# EAGLE design Minimum LPC2148 (EAGLE 5.11)
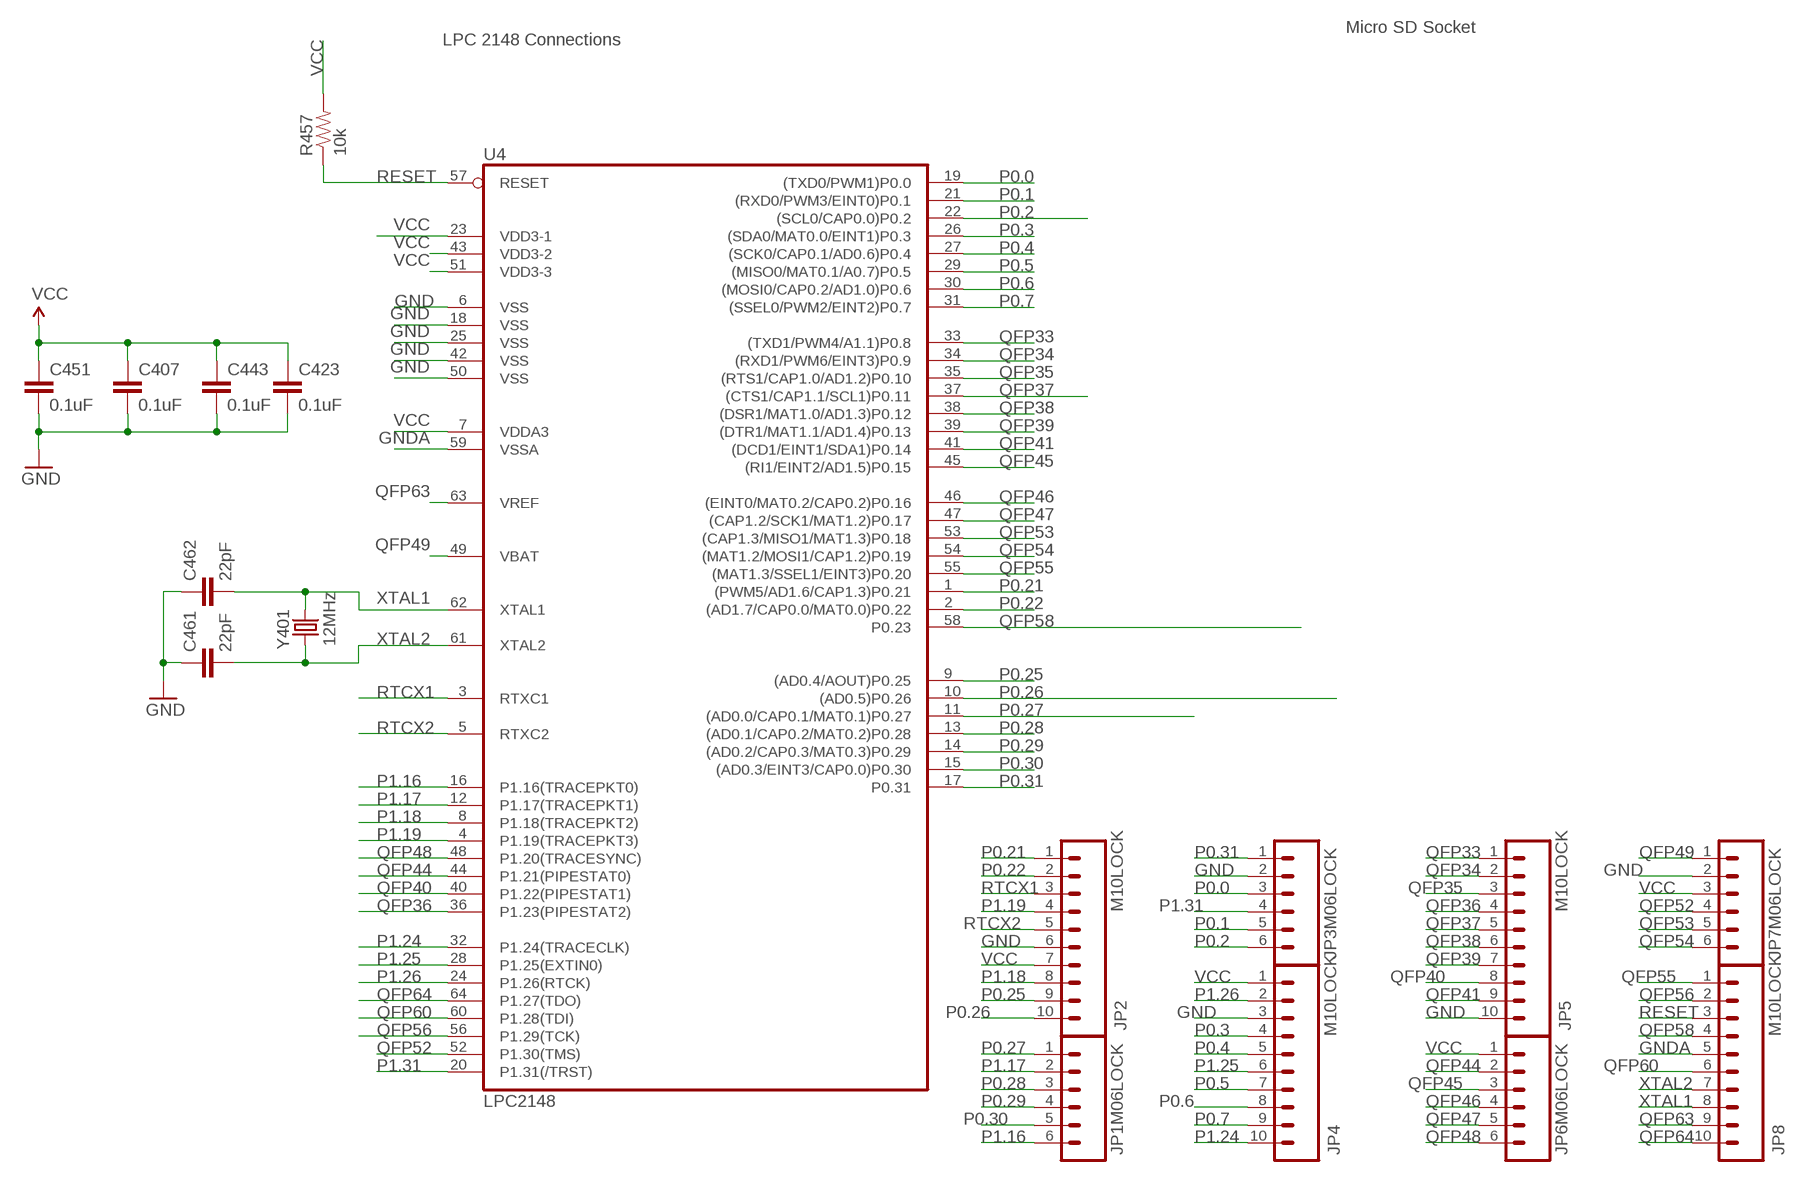
[diagram p0: schematic, sheet 1]

## Parts
C407  0.1uF  CAP0402-CAP  [0402-CAP]
C423  0.1uF  CAP0402-CAP  [0402-CAP]
C443  0.1uF  CAP0402-CAP  [0402-CAP]
C451  0.1uF  CAP0402-CAP  [0402-CAP]
C461  22pF  CAP0402-CAP  [0402-CAP]
C462  22pF  CAP0402-CAP  [0402-CAP]
JP1  M06LOCK  [1X06_LOCK]
JP2  M10LOCK  [1X10_LOCK]
JP3  M06LOCK  [1X06_LOCK]
JP4  M10LOCK  [1X10_LOCK]
JP5  M10LOCK  [1X10_LOCK]
JP6  M06LOCK  [1X06_LOCK]
JP7  M06LOCK  [1X06_LOCK]
JP8  M10LOCK  [1X10_LOCK]
R457  10k  RESISTOR0402-RES  [0402-RES]
U4  LPC2148  LPC213X  [SQFP-S-10X10-64]
Y401  12MHz  CRYSTAL5X3  [CRYSTAL-SMD-5X3]

## Nets
GND: C407.2 C423.2 C443.2 C451.2 C461.1 C462.1 JP2.6 JP3.2 JP4.3 JP5.10 JP7.2 U4.6(VSS) U4.18(VSS) U4.25(VSS) U4.42(VSS) U4.50(VSS)
GNDA: JP8.5 U4.59(VSSA)
P0.0: JP3.3 U4.19((TXD0/PWM1)P0.0)
P0.1: JP3.5 U4.21((RXD0/PWM3/EINT0)P0.1)
P0.2: JP3.6 U4.22((SCL0/CAP0.0)P0.2)
P0.3: JP4.4 U4.26((SDA0/MAT0.0/EINT1)P0.3)
P0.4: JP4.5 U4.27((SCK0/CAP0.1/AD0.6)P0.4)
P0.5: JP4.7 U4.29((MISO0/MAT0.1/A0.7)P0.5)
P0.6: JP4.8 U4.30((MOSI0/CAP0.2/AD1.0)P0.6)
P0.7: JP4.9 U4.31((SSEL0/PWM2/EINT2)P0.7)
P0.21: JP2.1 U4.1((PWM5/AD1.6/CAP1.3)P0.21)
P0.22: JP2.2 U4.2((AD1.7/CAP0.0/MAT0.0)P0.22)
P0.25: JP2.9 U4.9((AD0.4/AOUT)P0.25)
P0.26: JP2.10 U4.10((AD0.5)P0.26)
P0.27: JP1.1 U4.11((AD0.0/CAP0.1/MAT0.1)P0.27)
P0.28: JP1.3 U4.13((AD0.1/CAP0.2/MAT0.2)P0.28)
P0.29: JP1.4 U4.14((AD0.2/CAP0.3/MAT0.3)P0.29)
P0.30: JP1.5 U4.15((AD0.3/EINT3/CAP0.0)P0.30)
P0.31: JP3.1 U4.17(P0.31)
P1.16: JP1.6 U4.16(P1.16(TRACEPKT0))
P1.17: JP1.2 U4.12(P1.17(TRACEPKT1))
P1.18: JP2.8 U4.8(P1.18(TRACEPKT2))
P1.19: JP2.4 U4.4(P1.19(TRACEPKT3))
P1.24: JP4.10 U4.32(P1.24(TRACECLK))
P1.25: JP4.6 U4.28(P1.25(EXTIN0))
P1.26: JP4.2 U4.24(P1.26(RTCK))
P1.31: JP3.4 U4.20(P1.31(/TRST))
QFP33: JP5.1 U4.33((TXD1/PWM4/A1.1)P0.8)
QFP34: JP5.2 U4.34((RXD1/PWM6/EINT3)P0.9)
QFP35: JP5.3 U4.35((RTS1/CAP1.0/AD1.2)P0.10)
QFP36: JP5.4 U4.36(P1.23(PIPESTAT2))
QFP37: JP5.5 U4.37((CTS1/CAP1.1/SCL1)P0.11)
QFP38: JP5.6 U4.38((DSR1/MAT1.0/AD1.3)P0.12)
QFP39: JP5.7 U4.39((DTR1/MAT1.1/AD1.4)P0.13)
QFP40: JP5.8 U4.40(P1.22(PIPESTAT1))
QFP41: JP5.9 U4.41((DCD1/EINT1/SDA1)P0.14)
QFP44: JP6.2 U4.44(P1.21(PIPESTAT0))
QFP45: JP6.3 U4.45((RI1/EINT2/AD1.5)P0.15)
QFP46: JP6.4 U4.46((EINT0/MAT0.2/CAP0.2)P0.16)
QFP47: JP6.5 U4.47((CAP1.2/SCK1/MAT1.2)P0.17)
QFP48: JP6.6 U4.48(P1.20(TRACESYNC))
QFP49: JP7.1 U4.49(VBAT)
QFP52: JP7.4 U4.52(P1.30(TMS))
QFP53: JP7.5 U4.53((CAP1.3/MISO1/MAT1.3)P0.18)
QFP54: JP7.6 U4.54((MAT1.2/MOSI1/CAP1.2)P0.19)
QFP55: JP8.1 U4.55((MAT1.3/SSEL1/EINT3)P0.20)
QFP56: JP8.2 U4.56(P1.29(TCK))
QFP58: JP8.4 U4.58(P0.23)
QFP60: JP8.6 U4.60(P1.28(TDI))
QFP63: JP8.9 U4.63(VREF)
QFP64: JP8.10 U4.64(P1.27(TDO))
RESET: JP8.3 R457.1 U4.57(RESET)
RTCX1: JP2.3 U4.3(RTXC1)
RTCX2: JP2.5 U4.5(RTXC2)
VCC: C407.1 C423.1 C443.1 C451.1 JP2.7 JP4.1 JP6.1 JP7.3 R457.2 U4.7(VDDA3) U4.23(VDD3-1) U4.43(VDD3-2) U4.51(VDD3-3)
XTAL1: C462.2 JP8.8 U4.62(XTAL1) Y401.3
XTAL2: C461.2 JP8.7 U4.61(XTAL2) Y401.1

## Notes on the sheet
- Micro SD Socket
- LPC 2148 Connections

## Library data of the parts
C407 C423 C443 C451 C461 C462 = SparkFun:CAP: Capacitor Standard 0603 ceramic capacitor, and 0.1" leaded capacitor.
JP1 JP3 JP6 JP7 = SparkFun:M06: Header 6 Standard 6-pin 0.1" header. Use with straight break away headers (SKU : PRT-00116), right angle break away headers (PRT-00553), swiss pins (PRT-00743), machine pins (PRT-00117), and female headers (PRT-00115). Molex polarized connector foot print use with SKU : PRT-08094 with associated crimp pins and housings. NOTES ON THE VARIANTS LOCK and LOCK_LONGPADS... This footprint was designed to help hold the alignment of a through-hole component (i.e. 6-pin header) while soldering it into place. You may notice that each hole has been shifted either up or down by 0.005 of an inch from it's more standard position (which is a perfectly straight line). This slight alteration caused the pins (the squares in the middle) to touch the edges of the holes. Because they are alternating, it causes a "brace" to hold the component in place. 0.005 has proven to be the perfect amount of "off-center" position when using our standard breakaway headers. Although looks a little odd when you look at the bare footprint, once you have a header in there, the alteration is very hard to notice. Also, if you push a header all the way into place, it is covered up entirely on the bottom side. This idea of altering the position of holes to aid alignment will be further integrated into the Sparkfun Library for other footprints. It can help hold any component with 3 or more connection pins.
JP2 JP4 JP5 JP8 = SparkFun:M10: Header 10 Standard 10-pin 0.1" header. Use with straight break away headers (SKU : PRT-00116), right angle break away headers (PRT-00553), swiss pins (PRT-00743), machine pins (PRT-00117), and female headers (PRT-00115).
R457 = SparkFun:RESISTOR: Resistor Basic schematic elements and footprints for 0603, 1206, and PTH resistors.
U4 = SparkFun:LPC213X: LPC213x Schematic element and footprint for NXP LPC213x. Spark Fun Electronics SKU : COM-00520
Y401 = SparkFun:CRYSTAL: Crystals Various standard crystals. Proven footprints. Spark Fun Electronics SKU : COM-00534

## Net classes
0 default: width 0.152 mm, drill 0.33 mm, clearance 0.152 mm
1 power: width 0.152 mm, drill 0.33 mm, clearance 0.152 mm to class 0, clearance 0.152 mm
2 hv: width 0.254 mm, clearance 0.229 mm

## Board
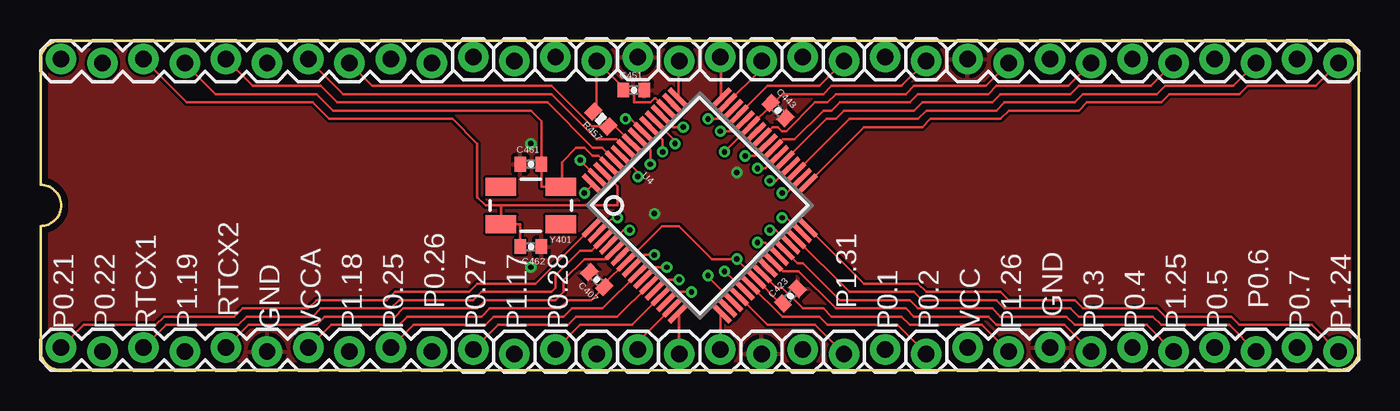
[diagram p1: board, top side]
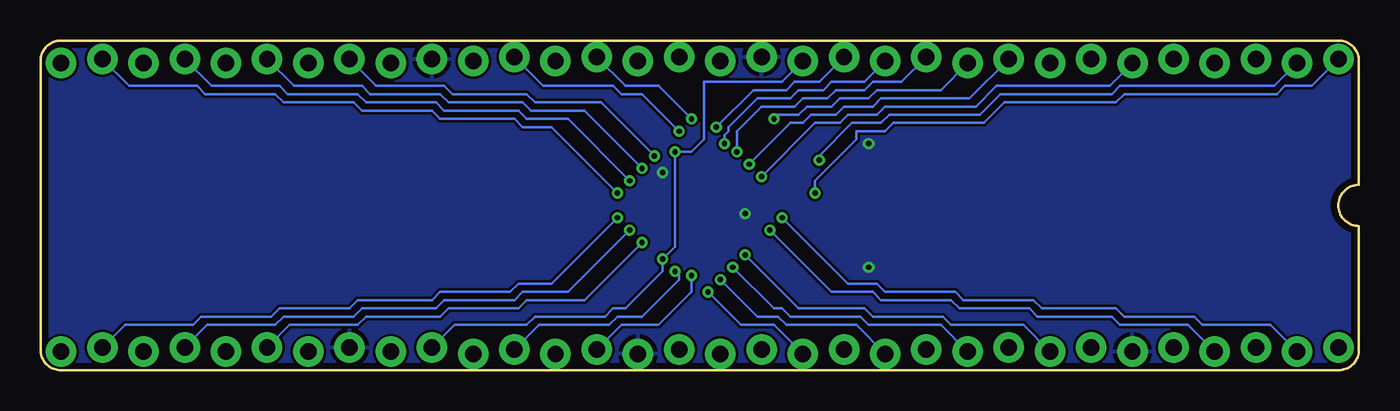
[diagram p2: board, bottom side, seen from below]

Size 81.28 x 20.32 mm. Coordinates in mm from the lower left corner, seen from the top.
Outline: 1.27,20.32 80.01,20.32 arc-90 81.28,19.05 81.28,1.27 arc-90 80.01,0 1.27,0 arc-90 0,1.27 0,8.89 arc90 1.27,10.16 arc90 0,11.43 0,19.05 arc-90 1.27,20.32
Copper layers (1*16): Top 0.0356mm / dielectric 1.5011mm / Bottom 0.0356mm
Design rules "LaenPCBOrder": minimum track width 6mil, minimum drill 13mil, track to track 6mil, track to pad 6mil, pad to pad 6mil, via to via 6mil, smd to smd 6mil, copper to edge 15mil, drill to drill 6mil, minimum pad ring 7mil, minimum via ring 7mil, stop-mask expansion 4mil, vias tented up to drill 0mil, thermal gap 10mil

### Footprints (pad centres in the part's own frame; a part is rotated, then mirrored left to right if it is on the bottom)
0402-CAP = smd 0.7 x 0.9: 1 -0.65,0; 2 0.65,0
1X06_LOCK = drill 1.016 pad 1.88 round: 1 0,0; 2 2.54,-0.254; 3 5.08,0; 4 7.62,-0.254; 5 10.16,0; 6 12.7,-0.254
1X10_LOCK = drill 1.016 pad 1.88 round: 1 0,0.127; 2 2.54,-0.127; 3 5.08,0.127; 4 7.62,-0.127; 5 10.16,0.127; 6 12.7,-0.127; 7 15.24,0.127; 8 17.78,-0.127; 9 20.32,0.127; 10 22.86,-0.127
0402-RES = smd 0.7 x 0.9: 1 -0.65,0; 2 0.65,0
SQFP-S-10X10-64 = smd 0.3 x 1.6: 1 -3.75,-5.6; 2 -3.25,-5.6; 3 -2.75,-5.6; 4 -2.25,-5.6; 5 -1.75,-5.6; 6 -1.25,-5.6; 7 -0.75,-5.6; 8 -0.25,-5.6; 9 0.25,-5.6; 10 0.75,-5.6; 11 1.25,-5.6; 12 1.75,-5.6; 13 2.25,-5.6; 14 2.75,-5.6; 15 3.25,-5.6; 16 3.75,-5.6; 33 3.75,5.6; 34 3.25,5.6; 35 2.75,5.6; 36 2.25,5.6; 37 1.75,5.6; 38 1.25,5.6; 39 0.75,5.6; 40 0.25,5.6; 41 -0.25,5.6; 42 -0.75,5.6; 43 -1.25,5.6; 44 -1.75,5.6; 45 -2.25,5.6; 46 -2.75,5.6; 47 -3.25,5.6; 48 -3.75,5.6 | smd 1.6 x 0.3: 17 5.6,-3.75; 18 5.6,-3.25; 19 5.6,-2.75; 20 5.6,-2.25; 21 5.6,-1.75; 22 5.6,-1.25; 23 5.6,-0.75; 24 5.6,-0.25; 25 5.6,0.25; 26 5.6,0.75; 27 5.6,1.25; 28 5.6,1.75; 29 5.6,2.25; 30 5.6,2.75; 31 5.6,3.25; 32 5.6,3.75; 49 -5.6,3.75; 50 -5.6,3.25; 51 -5.6,2.75; 52 -5.6,2.25; 53 -5.6,1.75; 54 -5.6,1.25; 55 -5.6,0.75; 56 -5.6,0.25; 57 -5.6,-0.25; 58 -5.6,-0.75; 59 -5.6,-1.25; 60 -5.6,-1.75; 61 -5.6,-2.25; 62 -5.6,-2.75; 63 -5.6,-3.25; 64 -5.6,-3.75
CRYSTAL-SMD-5X3 = smd 1.9 x 1.1: 1 -1.85,-1.15; 2 1.85,-1.15; 3 1.85,1.15; 4 -1.85,1.15

### Placement (x,y rotation side)
C407  34.29,5.59 135 top
C423  46.23,4.57 45 top
C443  45.47,16 315 top
C451  36.58,17.27 0 top
C461  30.23,12.7 0 top
C462  30.23,7.62 180 top
JP1  26.67,1.27 0 top
JP2  1.27,1.27 0 top
JP3  41.91,1.27 0 top
JP4  57.15,1.27 0 top
JP5  80.01,19.05 180 top
JP6  54.61,19.05 180 top
JP7  39.37,19.05 180 top
JP8  24.13,19.05 180 top
R457  34.54,15.49 135 top
U4  40.64,10.16 315 top
Y401  30.23,10.16 180 top

### Tracks (layer width: path | path; a pad name or v marks a point on that pad's centre or on a via)
GND  (via drill 0.33)
  other vias: 30.23,6.35 42.93,12.19 30.23,13.97 37.85,9.65
  pour Top: 0,1.27 0,19.05 arc-90 1.27,20.32 80.01,20.32 arc-90 81.28,19.05 81.28,1.27 arc-90 80.01,0 1.27,0 arc-90
  pour Bottom: 0,1.27 0,19.05 arc-90 1.27,20.32 80.01,20.32 arc-90 81.28,19.05 81.28,1.27 arc-90 80.01,0 1.27,0 arc-90
GNDA  (via drill 0.33)
  Top 0.152: U4.59 36.83,12.2 v36.83,11.94
  Bottom 0.152: v36.83,11.94 33.53,15.24 32,15.24 31.5,15.75 29.72,15.75 29.21,16.26 23.62,16.26 22.35,17.53 15.37,17.53 JP8.5
P0.0  (via drill 0.33)
  Top 0.152: 42.09,4.83 U4.19 41.15,5.76 v41.15,5.84
  Bottom 0.152: JP3.3 45.47,2.79 43.18,2.79 41.15,4.83 v41.15,5.84
P0.1  (via drill 0.33)
  Top 0.152: 42.23,6.1 v42.16,6.1 U4.21
  Bottom 0.152: JP3.5 50.55,2.79 46.23,2.79 45.72,3.3 44.2,3.3 41.91,5.59 41.91,5.84 v42.16,6.1
P0.2
  Top 0.152: U4.22 45.73,3.3 48.01,3.3 48.51,2.79 52.83,2.79 JP3.6
P0.3
  Top 0.152: JP4.4 63.12,2.79 58.93,2.79 58.42,3.3 53.85,3.3 53.34,3.81 49.02,3.81 46.74,6.1 45.77,6.1 U4.26
P0.4  (via drill 0.33)
  Top 0.152: U4.27 44.69,7.87 v44.2,7.87
  Bottom 0.152: v44.2,7.87 47.75,4.32 51.31,4.32 51.82,3.81 56.13,3.81 56.64,3.3 61.21,3.3 61.72,2.79 65.91,2.79 JP4.5
P0.5  (via drill 0.33)
  Top 0.152: U4.29 45.35,8.64 v44.96,8.64
  Bottom 0.152: v44.96,8.64 48.77,4.83 51.56,4.83 52.07,4.32 56.39,4.32 56.9,3.81 61.47,3.81 61.98,3.3 66.29,3.3 66.8,2.79 70.99,2.79 JP4.7
P0.6
  Top 0.152: U4.30 49.86,4.83 53.85,4.83 54.36,4.32 58.93,4.32 59.44,3.81 63.5,3.81 64.01,3.3 68.58,3.3 69.09,2.79 73.28,2.79 JP4.8
P0.7  (via drill 0.33)
  Top 0.152: U4.31 46,9.4 v45.72,9.4
  Bottom 0.152: v45.72,9.4 49.78,5.33 51.82,5.33 52.32,4.83 56.64,4.83 57.15,4.32 61.72,4.32 62.23,3.81 66.55,3.81 67.06,3.3 71.37,3.3 71.88,2.79 76.07,2.79 JP4.9
P0.21
  Top 0.152: U4.1 30.51,5.33 26.92,5.33 26.42,4.83 21.84,4.83 21.34,4.32 17.02,4.32 16.51,3.81 12.45,3.81 11.94,3.3 7.62,3.3 7.11,2.79 2.67,2.79 JP2.1
P0.22  (via drill 0.33)
  Top 0.152: U4.2 35.28,9.4 v35.56,9.4
  Bottom 0.152: v35.56,9.4 31.5,5.33 29.72,5.33 29.21,4.83 24.89,4.83 24.38,4.32 20.07,4.32 19.56,3.81 14.99,3.81 14.48,3.3 10.16,3.3 9.65,2.79 5.46,2.79 JP2.2
P0.25
  Top 0.152: U4.9 34.64,3.81 32.77,3.81 32.26,3.3 27.94,3.3 27.43,2.79 22.99,2.79 JP2.9
P0.26  (via drill 0.33)
  Top 0.152: U4.10 37.89,6.35 v38.61,6.35
  Bottom 0.152: v38.61,6.35 36.07,3.81 35.56,3.81 35.05,3.3 30.73,3.3 30.23,2.79 25.78,2.79 JP2.10
P0.27
  Top 0.152: U4.11 35.55,3.3 33.02,3.3 32.51,2.79 28.19,2.79 JP1.1
P0.28
  Top 0.152: U4.13 36.46,2.79 33.27,2.79 JP1.3
P0.29  (via drill 0.33)
  Top 0.152: U4.14 39.2,4.83 v40.13,4.83
  Bottom 0.152: v40.13,4.83 38.1,2.79 36.07,2.79 JP1.4
P0.30
  Top 0.152: U4.15 36.83,1.75 JP1.5
P0.31
  Top 0.152: U4.17 41.91,3.51 JP3.1
P1.16
  Top 0.152: U4.16 39.37,3.51 JP1.6
P1.17  (via drill 0.33)
  Top 0.152: U4.12 38.54,5.59 v39.37,5.59
  Bottom 0.152: v39.37,5.59 37.08,3.3 35.81,3.3 35.31,2.79 30.99,2.79 JP1.2
P1.18  (via drill 0.33)
  Top 0.152: U4.8 37.24,7.11 v37.85,7.11
  Bottom 0.152: v37.85,7.11 34.54,3.81 30.48,3.81 29.97,3.3 25.65,3.3 25.15,2.79 20.7,2.79 JP2.8
P1.19  (via drill 0.33)
  Top 0.152: U4.4 35.93,8.64 v36.32,8.64
  Bottom 0.152: v36.32,8.64 32.51,4.83 29.97,4.83 29.46,4.32 25.15,4.32 24.64,3.81 20.32,3.81 19.81,3.3 15.24,3.3 14.73,2.79 10.54,2.79 JP2.4
P1.24
  Top 0.152: U4.32 50.77,5.33 54.1,5.33 54.61,4.83 59.18,4.83 59.69,4.32 63.75,4.32 64.26,3.81 68.83,3.81 69.34,3.3 73.41,3.3 73.91,2.79 78.36,2.79 JP4.10
P1.25
  Top 0.152: JP4.6 68.2,2.79 63.75,2.79 63.25,3.3 59.18,3.3 58.67,3.81 54.1,3.81 53.59,4.32 49.28,4.32 46.99,6.6 46.67,6.6 U4.28
P1.26
  Top 0.152: JP4.2 58.04,2.79 53.59,2.79 53.09,3.3 48.77,3.3 48.26,3.81 46.99,3.81 45.72,5.08 45.37,5.08 U4.24
P1.31
  Top 0.152: JP3.4 47.75,2.79 44.82,2.79 U4.20
QFP33
  Top 0.152: U4.33 50.77,14.99 54.36,14.99 54.86,15.49 59.18,15.49 59.69,16 64.01,16 64.52,16.51 69.09,16.51 69.6,17.02 73.91,17.02 74.42,17.53 78.61,17.53 JP5.1
QFP34  (via drill 0.33)
  Top 0.152: U4.34 46,10.92 v45.72,10.92
  Bottom 0.152: v45.72,10.92 49.78,14.99 51.56,14.99 52.07,15.49 56.64,15.49 57.15,16 61.47,16 61.98,16.51 66.29,16.51 66.8,17.02 71.12,17.02 71.63,17.53 75.82,17.53 JP5.2
QFP35
  Top 0.152: U4.35 49.86,15.49 54.1,15.49 54.61,16 58.93,16 59.44,16.51 63.75,16.51 64.26,17.02 68.83,17.02 69.34,17.53 73.53,17.53 JP5.3
QFP36  (via drill 0.33)
  Top 0.152: U4.36 45.35,11.68 v44.96,11.68
  Bottom 0.152: v44.96,11.68 48.77,15.49 51.31,15.49 51.82,16 56.39,16 56.9,16.51 61.21,16.51 61.72,17.02 66.04,17.02 66.55,17.53 70.74,17.53 JP5.4
QFP37
  Top 0.152: U4.37 48.45,15.49 49.02,15.49 49.53,16 53.85,16 54.36,16.51 58.67,16.51 59.18,17.02 63.5,17.02 64.01,17.53 68.45,17.53 JP5.5
QFP38  (via drill 0.33)
  Top 0.152: U4.38 44.69,12.45 v44.2,12.45
  Bottom 0.152: v44.2,12.45 47.75,16 51.05,16 51.56,16.51 56.13,16.51 56.64,17.02 60.96,17.02 61.47,17.53 65.66,17.53 JP5.6
QFP39
  Top 0.152: JP5.7 63.37,17.53 58.93,17.53 58.42,17.02 54.1,17.02 53.59,16.51 49.28,16.51 48.77,16 48.26,16 46.48,14.22 45.77,14.22 U4.39
QFP40  (via drill 0.33)
  Top 0.152: U4.40 44.04,13.21 v43.43,13.21
  Bottom 0.152: v43.43,13.21 46.74,16.51 50.8,16.51 51.31,17.02 55.88,17.02 56.39,17.53 60.58,17.53 JP5.8
QFP41
  Top 0.152: JP5.9 58.29,17.53 53.85,17.53 53.34,17.02 49.02,17.02 48.51,16.51 47.75,16.51 45.97,14.73 45.72,14.73 45.47,14.99 45.11,14.99 U4.41
QFP44  (via drill 0.33)
  Top 0.152: U4.44 42.74,14.73 v41.91,14.73
  Bottom 0.152: v41.91,14.73 44.2,17.02 45.47,17.02 45.97,17.53 50.29,17.53 JP6.2
QFP45
  Top 0.152: U4.45 44.82,17.53 48.01,17.53 JP6.3
QFP46  (via drill 0.33)
  Top 0.152: U4.46 42.09,15.49 v41.15,15.49
  Bottom 0.152: JP6.4 45.21,17.53 43.18,17.53 v41.15,15.49
QFP47
  Top 0.152: U4.47 44.45,18.57 JP6.5
QFP48
  Top 0.152: JP6.6 41.95,19.27 U4.48
QFP49
  Top 0.152: JP7.1 39.33,19.01 U4.49
QFP52  (via drill 0.33)
  Top 0.152: U4.52 39,14.99 v39.62,14.99
  Bottom 0.152: v39.62,14.99 37.34,17.27 35.31,17.27 34.8,17.78 33.27,17.78 JP7.4
QFP53  (via drill 0.33)
  Top 0.152: U4.53 39.12,14.16 v39.12,13.97
  Bottom 0.152: JP7.5 30.48,17.78 32.51,17.78 33.02,17.27 34.54,17.27 35.05,16.76 37.08,16.76 38.86,14.99 38.86,14.73 39.12,14.48 v39.12,13.97
QFP54  (via drill 0.33)
  Top 0.152: U4.54 38.35,14.21 v38.35,13.46
  Bottom 0.152: v38.35,13.46 38.35,14.73 36.83,16.26 34.8,16.26 34.29,16.76 32.77,16.76 32.26,17.27 30.48,17.27 29.97,17.78 28.19,17.78 JP7.6
QFP55  (via drill 0.33)
  Top 0.152: U4.55 36.37,15.49 v36.07,15.49
  Bottom 0.152: JP8.1 25.78,17.27 29.72,17.27 30.23,16.76 32,16.76 32.51,16.26 34.04,16.26 34.54,15.75 35.81,15.75 v36.07,15.49
QFP56  (via drill 0.33)
  Top 0.152: U4.56 37.59,13.56 v37.59,12.7
  Bottom 0.152: v37.59,12.7 35.05,15.24 34.29,15.24 33.78,15.75 32.26,15.75 31.75,16.26 29.97,16.26 29.46,16.76 24,16.76 JP8.2
QFP58
  Top 0.152: U4.58 35.52,14.22 34.29,14.22 31.5,17.02 18.67,17.02 JP8.4
QFP60
  Top 0.152: U4.60 34.61,13.72 34.04,13.72 31.24,16.51 18.29,16.51 17.27,17.53 13.08,17.53 JP8.6
QFP63  (via drill 0.33)
  Top 0.152: U4.63 34.38,11.85 v33.27,12.95
  Bottom 0.152: JP8.9 5.21,17.53 14.73,17.53 15.24,17.02 22.1,17.02 23.37,15.75 28.96,15.75 29.46,15.24 31.24,15.24 33.27,13.21 v33.27,12.95
QFP64  (via drill 0.33)
  Top 0.152: U4.64 34.03,11.42 v33.53,10.92
  Bottom 0.152: v33.53,10.92 33.53,11.68 30.99,14.22 30.99,14.73 29.21,14.73 28.7,15.24 23.11,15.24 21.84,16.51 14.99,16.51 14.48,17.02 5.08,17.02 4.57,17.53 2.92,17.53 JP8.10
RESET
  Top 0.152: U4.57 35.41,15.03 R457.1 33.99,15.03 31.5,17.53 20.45,17.53 JP8.3
RTCX1
  Top 0.152: JP2.3 7.75,2.79 12.19,2.79 12.7,3.3 16.76,3.3 17.27,3.81 21.59,3.81 22.1,4.32 26.67,4.32 27.18,4.83 31.5,4.83 31.75,5.08 31.75,5.84 33.27,7.37 33.96,7.37 U4.3
RTCX2
  Top 0.152: JP2.5 12.83,2.79 17.02,2.79 17.53,3.3 21.84,3.3 22.35,3.81 26.92,3.81 27.43,4.32 31.75,4.32 32.26,4.83 32.26,5.59 33.53,6.86 34.86,6.86 U4.5
VCC  (via drill 0.33)
  Top 0.152: C423.1 45.63,4.11 U4.23 42.93,6.81 v42.93,6.86 41.4,6.86 39.37,8.89 38.31,8.89 U4.7 34.75,5.33 C407.1 33.94,4.32 32.51,4.32 32,3.81 27.69,3.81 27.18,3.3 22.61,3.3 22.1,2.79 17.91,2.79 JP2.7 | JP6.1 53.09,17.53 48.77,17.53 48.26,17.02 45.73,17.02 45.17,16.46 | 45.17,16.46 U4.43 43.71,15 v42.16,13.46 | 45.17,16.46 C443.1 | R457.2 34.29,15.95 JP7.3 35.93,17.41 C451.1 36.58,17.27 36.58,16.51 37.59,16.51 37.85,16.76 37.92,16.76 U4.51
  Bottom 0.152: JP4.1 55.75,2.79 51.31,2.79 50.8,3.3 46.48,3.3 45.97,3.81 45.21,3.81 42.93,6.1 v42.93,6.86 42.16,7.62 v42.16,13.46 41.15,13.46 40.39,14.22 40.39,17.78 35.56,17.78 JP7.3
XTAL1
  Top 0.152: U4.62 35.56,11.35 35.56,10.16 28.38,10.16 | 28.38,10.16 Y401.3 29.58,9.01 C462.2 | 28.38,10.16 27.43,10.16 26.92,10.67 26.92,13.97 25.4,15.49 17.78,15.49 16.76,16.51 9.02,16.51 JP8.8
XTAL2
  Top 0.152: JP8.7 10.79,17.02 17.02,17.02 18.03,16 30.23,16 30.88,15.35 C461.2 30.88,11.31 Y401.1 32.14,11.31 32.14,12.83 33.02,13.72 33.53,13.72 34.04,13.21 34.41,13.21 U4.61

### Text on the board
tPlace: P0.26 | P1.31 | P0.6 | P0.21 | P0.22 | RTCX1 | P1.19 | RTCX2 | GND | VCCA | P1.18 | P0.25 | P0.27 | P1.17 | P0.28 | P0.1 | P0.2 | VCC | P1.26 | GND | P0.3 | P0.4 | P1.25 | P0.5 | P0.7 | P1.24